# Altium schematic sheet DRV8301_driver.SchDoc
size 594 x 420 mm; SheetNumber: 5; SheetTotal: 8
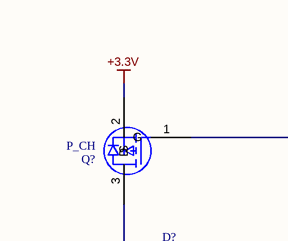
[diagram p0: DRV8301_driver.SchDoc, top left]
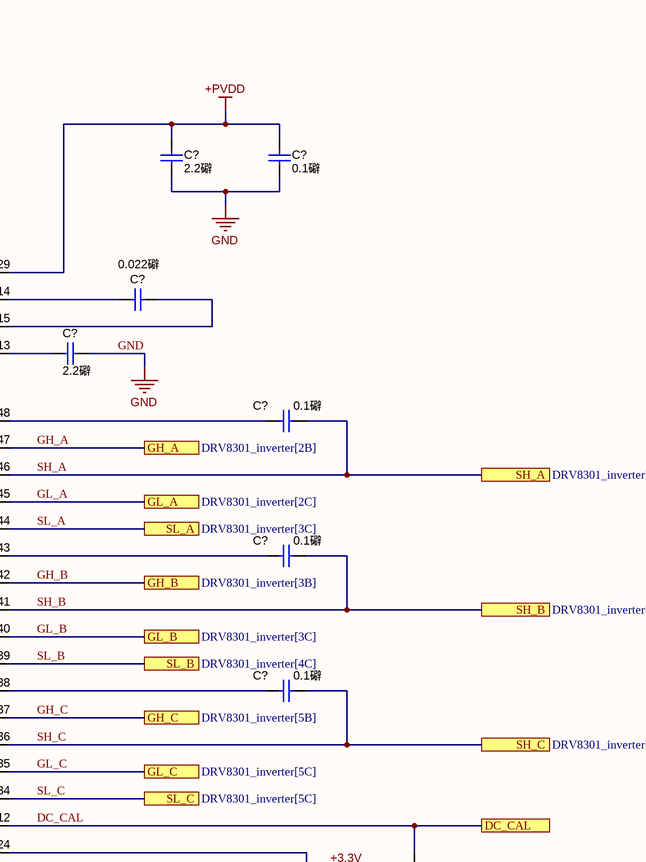
[diagram p1: DRV8301_driver.SchDoc, top right]
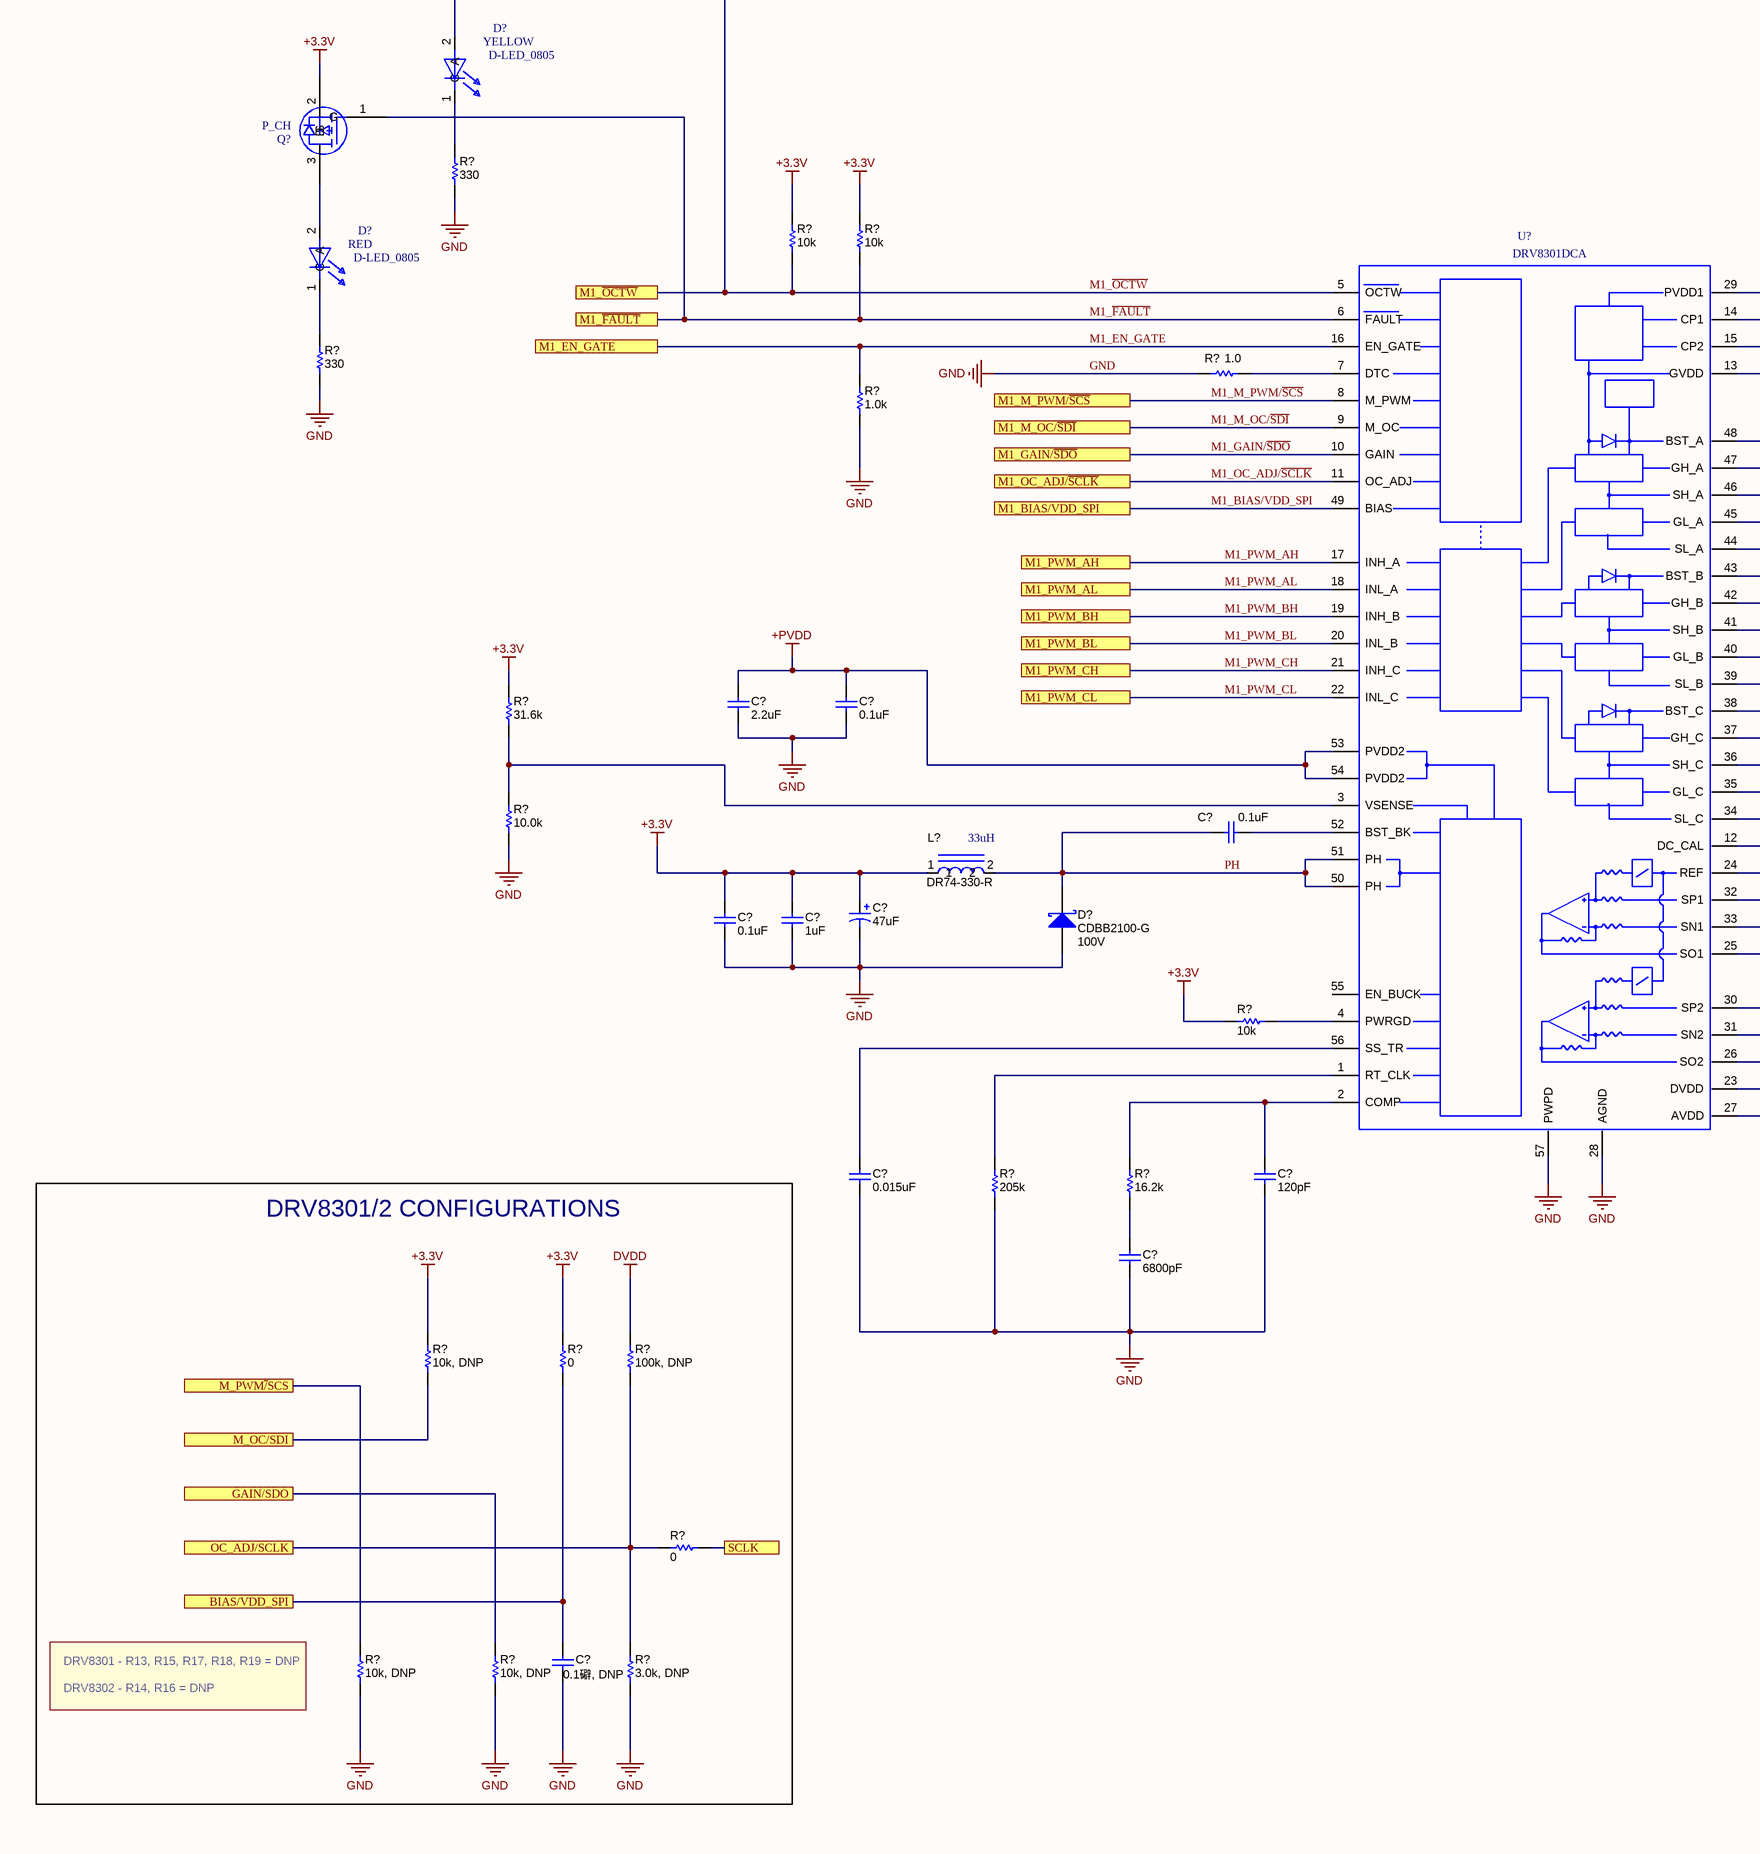
[diagram p2: DRV8301_driver.SchDoc, bottom left]
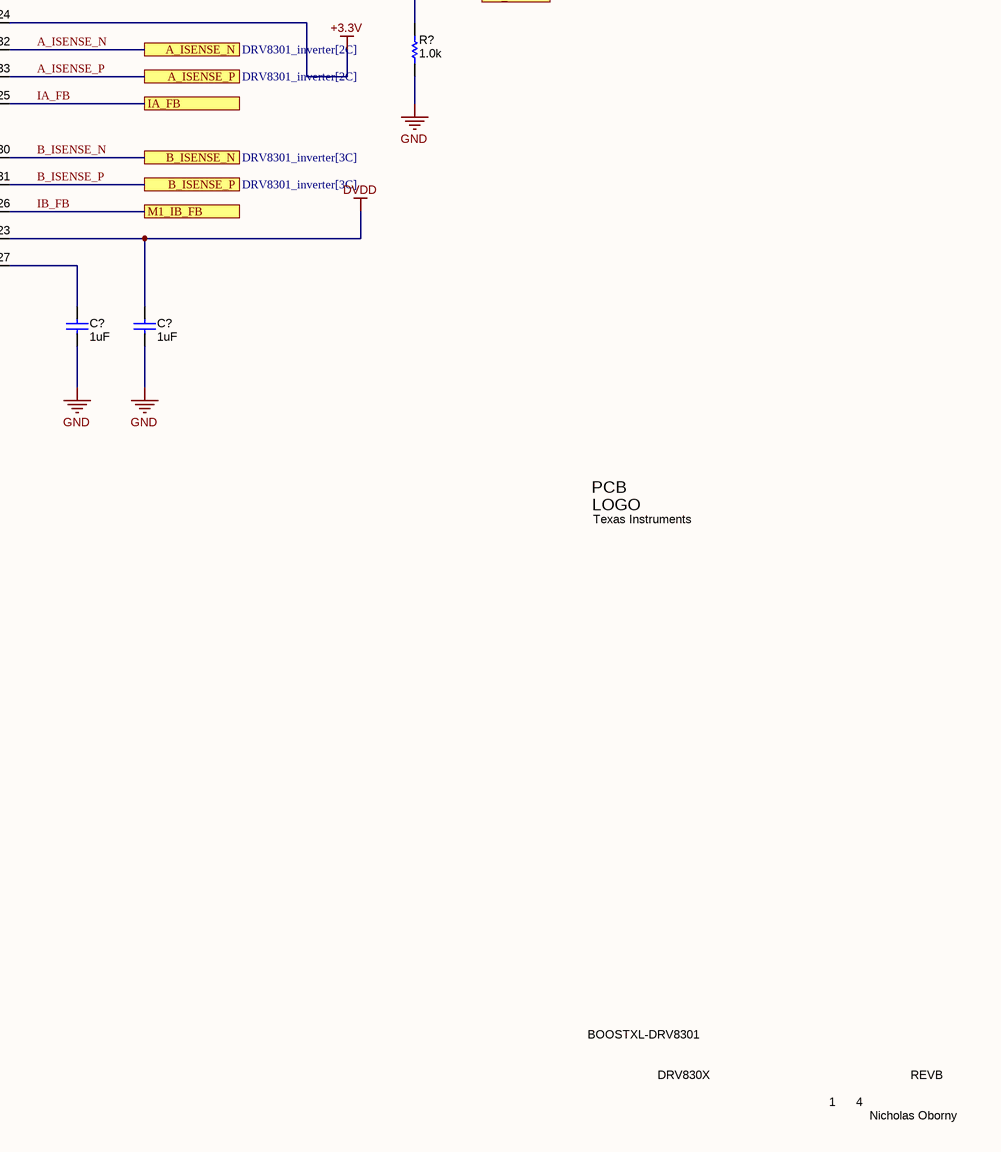
[diagram p3: DRV8301_driver.SchDoc, bottom right]

## Parts
(Parts that share a designator on the sheet are numbered #1, #2 ... from top to bottom, then left to right.)
C?#1  ValueDisplayed: 2.2礔  [1210L]  (hidden comment: GRM32ER72A225KA35L)
C?#2  ValueDisplayed: 0.1礔  [0603L]  (hidden comment: GRM188R72A104KA35D)
C?#3  ValueDisplayed: 0.022礔  [0603L]  (hidden comment: C1608X7R1H223K)
C?#4  ValueDisplayed: 2.2礔  [0805L]  (hidden comment: GRM219R61E225KA12D)
C?#5  ValueDisplayed: 0.1礔  [0603L]  (hidden comment: C1608X7R1H104K)
C?#6  ValueDisplayed: 0.1礔  [0603L]  (hidden comment: C1608X7R1H104K)
C?#7  ValueDisplayed: 2.2uF  [1210L]  (hidden comment: GRM32ER72A225KA35L)
C?#8  ValueDisplayed: 0.1uF  [0603L]  (hidden comment: GRM188R72A104KA35D)
C?#9  ValueDisplayed: 0.1礔  [0603L]  (hidden comment: C1608X7R1H104K)
C?#10  ValueDisplayed: 0.1uF  [0603L]  (hidden comment: C1608X7R1H104K)
C?#11  ValueDisplayed: 0.1uF  [0603L]  (hidden comment: C1608X7R1E104K)
C?#12  ValueDisplayed: 1uF  [0603L]  (hidden comment: C1608X5R1E105K080AC)
C?#13  ValueDisplayed: 47uF  [SM_RADIAL_D]  (hidden comment: EEE-FK1E470P)
C?#14  ValueDisplayed: 0.015uF  [0603L]  (hidden comment: GRM188R71H153KA01D)
C?#15  ValueDisplayed: 120pF  [0603L]  (hidden comment: GRM1885C1H121JA01D)
C?#16  ValueDisplayed: 1uF  [0603L]  (hidden comment: GRM188R61E105KA12D)
C?#17  ValueDisplayed: 1uF  [0603L]  (hidden comment: GRM188R61E105KA12D)
C?#18  ValueDisplayed: 6800pF  [0603L]  (hidden comment: GRM188R71H682KA01D)
C?#19  ValueDisplayed: 0.1礔, DNP  [0603L]  (hidden comment: C1608X7R1E104K)
D?#1  D-LED_0805  value YELLOW  [LED_0805]
D?#2  D-LED_0805  value RED  [LED_0805]
D?#3  CDBB2100-G  value 100V  [SMB]
L?  DR74-330-R  value 33uH  [IND_DR74]
Logo?  Texas Instruments  [TI_Symbol_Overlay_Small]  (no BOM)
Q?#1  value P_CH  [SOT-23]  (hidden comment: TR_PFET_SOT23)
Q?#2  value P_CH  [SOT-23]  (hidden comment: TR_PFET_SOT23)
R?#1  value 330  [0603L]  (hidden comment: CRCW0603330RJNEA)
R?#2  value 10k  [0603L]  (hidden comment: CRCW060310K0JNEA)
R?#3  value 10k  [0603L]  (hidden comment: CRCW060310K0JNEA)
R?#4  value 330  [0603L]  (hidden comment: CRCW0603330RJNEA)
R?#5  value 1.0  [0603L]  (hidden comment: CRCW06031R00JNEA)
R?#6  value 1.0k  [0603L]  (hidden comment: CRCW06031K00JNEA)
R?#7  value 31.6k  [0603L]  (hidden comment: CRCW060331K6FKEA)
R?#8  value 10.0k  [0603L]  (hidden comment: RG1608P-103-B-T5)
R?#9  value 1.0k  [0603L]  (hidden comment: CRCW06031K00JNEA)
R?#10  value 10k  [0603L]  (hidden comment: CRCW060310K0JNEA)
R?#11  value 205k  [0603L]  (hidden comment: CRCW0603205KFKEA)
R?#12  value 16.2k  [0603L]  (hidden comment: CRCW060316K2FKEA)
R?#13  value 10k, DNP  [0603L]  (hidden comment: CRCW060310K0JNEA)
R?#14  value 0  [0603L]  (hidden comment: CRCW06030000Z0EA)
R?#15  value 100k, DNP  [0603L]  (hidden comment: CRCW0603100KJNEA)
R?#16  value 0  [0603L]  (hidden comment: CRCW06030000Z0EA)
R?#17  value 10k, DNP  [0603L]  (hidden comment: CRCW060310K0JNEA)
R?#18  value 10k, DNP  [0603L]  (hidden comment: CRCW060310K0JNEA)
R?#19  value 3.0k, DNP  [0603L]  (hidden comment: CRCW06033K00JNEA)
U?  DRV8301DCA  [DCA_56P]

## Blocks framed on the sheet
DRV8301/2 CONFIGURATIONS: C?#19 R?#13-R?#19

## Ports
A_ISENSE_N (see DRV8301_inverter[2C]), A_ISENSE_P (see DRV8301_inverter[2C]), B_ISENSE_N (see DRV8301_inverter[3C]), B_ISENSE_P (see DRV8301_inverter[3C]), BIAS/VDD_SPI, DC_CAL, GAIN/SDO, GH_A (see DRV8301_inverter[2B]), GH_B (see DRV8301_inverter[3B]), GH_C (see DRV8301_inverter[5B]), GL_A (see DRV8301_inverter[2C]), GL_B (see DRV8301_inverter[3C]), GL_C (see DRV8301_inverter[5C]), IA_FB, M1_BIAS/VDD_SPI, M1_EN_GATE, M1_GAIN/~{SDO}, M1_IB_FB, M1_M_OC/~{SDI}, M1_M_PWM/~{SCS}, M1_OC_ADJ/~{SCLK}, M1_PWM_AH, M1_PWM_AL, M1_PWM_BH, M1_PWM_BL, M1_PWM_CH, M1_PWM_CL, M1_~{FAULT}, M1_~{OCTW}, M_OC/SDI, M_PWM~{/}SCS, OC_ADJ/SCLK, SCLK, SH_A (see DRV8301_inverter[3B], DRV8301_SENSE[1C]), SH_B (see DRV8301_inverter[4B], DRV8301_SENSE[1D]), SH_C (see DRV8301_inverter[5B], DRV8301_SENSE[1E]), SL_A (see DRV8301_inverter[3C]), SL_B (see DRV8301_inverter[4C]), SL_C (see DRV8301_inverter[5C])

## Nets
+3.3V: C?#11.1 C?#12.1 C?#13.1(+) L?.1 Q?#1.2(S) Q?#2.2(S) R?#2.2 R?#3.2 R?#7.2 R?#10.2 R?#13.2 R?#14.2 U?.24(REF)
+PVDD: C?#1.1 C?#2.1 C?#7.1 C?#8.1 U?.29(PVDD1) U?.53(PVDD2) U?.54(PVDD2)
DVDD: C?#17.1 R?#15.1 U?.23(DVDD)
GND: C?#1.2 C?#2.2 C?#4.2 C?#7.2 C?#8.2 C?#11.2 C?#12.2 C?#13.2(-) C?#14.2 C?#15.2 C?#16.2 C?#17.2 C?#18.2 C?#19.2 D?#3.2(A) R?#1.1 R?#4.1 R?#5.1 R?#6.1 R?#8.1 R?#9.1 R?#11.1 R?#17.1 R?#18.1 R?#19.1 U?.28(AGND) U?.57(PWPD)
A_ISENSE_N: U?.32(SP1) ; port A_ISENSE_N
A_ISENSE_P: U?.33(SN1) ; port A_ISENSE_P
B_ISENSE_N: U?.30(SP2) ; port B_ISENSE_N
B_ISENSE_P: U?.31(SN2) ; port B_ISENSE_P
BIAS/VDD_SPI: C?#19.1 R?#14.1 ; port BIAS/VDD_SPI
DC_CAL: R?#9.2 U?.12(DC_CAL) ; port DC_CAL
GAIN/SDO: R?#18.2 ; port GAIN/SDO
GH_A: U?.47(GH_A) ; port GH_A
GH_B: U?.42(GH_B) ; port GH_B
GH_C: U?.37(GH_C) ; port GH_C
GL_A: U?.45(GL_A) ; port GL_A
GL_B: U?.40(GL_B) ; port GL_B
GL_C: U?.35(GL_C) ; port GL_C
IA_FB: U?.25(SO1) ; port IA_FB
IB_FB: U?.26(SO2) ; port M1_IB_FB
M1_BIAS/VDD_SPI: U?.49(BIAS) ; port M1_BIAS/VDD_SPI
M1_EN_GATE: R?#6.2 U?.16(EN_GATE) ; port M1_EN_GATE
M1_~{FAULT}: Q?#2.1(G) R?#3.1 U?.6(FAULT) ; port M1_~{FAULT}
M1_GAIN/~{SDO}: U?.10(GAIN) ; port M1_GAIN/~{SDO}
M1_M_OC/~{SDI}: U?.9(M_OC) ; port M1_M_OC/~{SDI}
M1_M_PWM/~{SCS}: U?.8(M_PWM) ; port M1_M_PWM/~{SCS}
M1_~{OCTW}: Q?#1.1(G) R?#2.1 U?.5(OCTW) ; port M1_~{OCTW}
M1_OC_ADJ/~{SCLK}: U?.11(OC_ADJ) ; port M1_OC_ADJ/~{SCLK}
M1_PWM_AH: U?.17(INH_A) ; port M1_PWM_AH
M1_PWM_AL: U?.18(INL_A) ; port M1_PWM_AL
M1_PWM_BH: U?.19(INH_B) ; port M1_PWM_BH
M1_PWM_BL: U?.20(INL_B) ; port M1_PWM_BL
M1_PWM_CH: U?.21(INH_C) ; port M1_PWM_CH
M1_PWM_CL: U?.22(INL_C) ; port M1_PWM_CL
M_OC/SDI: R?#13.1 ; port M_OC/SDI
M_PWM~{/}SCS: R?#17.2 ; port M_PWM~{/}SCS
OC_ADJ/SCLK: R?#15.2 R?#16.2 R?#19.2 ; port OC_ADJ/SCLK
PH: C?#10.1 D?#3.1(K) L?.2 U?.50(PH) U?.51(PH)
SCLK: R?#16.1 ; port SCLK
SH_A: C?#5.2 U?.46(SH_A) ; port SH_A
SH_B: C?#6.2 U?.41(SH_B) ; port SH_B
SH_C: C?#9.2 U?.36(SH_C) ; port SH_C
SL_A: U?.44(SL_A) ; port SL_A
SL_B: U?.39(SL_B) ; port SL_B
SL_C: U?.34(SL_C) ; port SL_C
NetC?#3_1: C?#3.1 U?.14(CP1)
NetC?#3_2: C?#3.2 U?.15(CP2)
NetC?#4_1: C?#4.1 U?.13(GVDD)
NetC?#5_1: C?#5.1 U?.48(BST_A)
NetC?#6_1: C?#6.1 U?.43(BST_B)
NetC?#9_1: C?#9.1 U?.38(BST_C)
NetC?#10_2: C?#10.2 U?.52(BST_BK)
NetC?#14_1: C?#14.1 U?.56(SS_TR)
NetC?#15_1: C?#15.1 R?#12.2 U?.2(COMP)
NetC?#16_1: C?#16.1 U?.27(AVDD)
NetC?#18_1: C?#18.1 R?#12.1
NetD?#1_1: D?#1.1(C) R?#1.2
NetD?#1_2: D?#1.2(A) Q?#1.3(D)
NetD?#2_1: D?#2.1(C) R?#4.2
NetD?#2_2: D?#2.2(A) Q?#2.3(D)
NetR?#5_2: R?#5.2 U?.7(DTC)
NetR?#7_1: R?#7.1 R?#8.2 U?.3(VSENSE)
NetR?#10_1: R?#10.1 U?.4(PWRGD)
NetR?#11_2: R?#11.2 U?.1(RT_CLK)

Not connected (* = marked no-connect by the designer): U? 55(EN_BUCK)

## Notes on the sheet
- DRV8301 - R13, R15, R17, R18, R19 = DNP
- DRV8302 - R14, R16 = DNP
- BOOSTXL-DRV8301
- DRV830X
- 1
- 4
- Nicholas Oborny
- REVB
- DWG NO:
- REV:
- THIS DOCUMENT AND THE DATA DISCLOSED HEREIN OR
- HEREWITH IS THE PROPERTY OF ALTIUM LIMITED AND MAY
- BE FREELY DISTRIBUTED IN WHOLE. NO RIGHTS ARE
- RESERVED OR EXPRESS OR IMPLIED WARANTEE GIVEN.
- REVISION
- DESCRIPTION
- DATE
- APPROVED
- ENG:
- APPROVALS
- PROJECT
- DSN:
- CHK:
- REFERENCE DOCUMENTS
- PROJECT REVISION:
- TITLE
- DOCUMENT REVISION:
- DESIGN ITEM:
- BOM:
- FAB DWG:
- PCB DWG:
- ASSY DWG:
- SCALE:
- A2
- SIZE
- CAGE CODE
- FILE NAME
- DWG NO.
- SHEET
- OF
- REV
- (in symbol TI_Logo) PCB; LOGO

## Library data of the parts
C?#1 C?#7 = GRM32ER72A225KA35L: CAP, CERM, 2.2uF, 100V, +/-10%, X7R, 1210; Manufacturer: MuRata; Polarized: N; CompType: Capacitor; U/M: EA; Cap_F: 0.0000022; Tolerance_%: 10; ESR_Ohm: 0.007; Value1: 0.007 ohm; VDC_V: 100; IRMS_A: 4.4; TaMin_C: -55; TaMax_C: 125; Cap_Case: 1210; SymbolVersion: 2008-07-09; Value: 2.2uF; PartNumber: GRM32ER72A225KA35L; PackageReference: 1210; RoHS: Y; Value2: 100V; MountType: SMT; Technology: Ceramic; TempCo: X7R; Published: 2008-06-19; Publisher: Texas Instruments; LatestRevisionDate: 2013-05-24; LatestRevisionNote: Changed publisher; ComponentLink1Description: Datasheet link; ComponentLink1URL: http://search.murata.co.jp/Ceramy/PnsearchViewAction.do?HnOFG=ON&HnNFG=ON&SEL_CNT=50&sLang=en&sKey=GRM32ER72A225KA35L&x=9&y=9&search=startwith; Supplier 1: Digi-Key; Supplier Part Number 1: 490-3385-1-ND; Supplier 2: Mouser; Supplier Part Number 2: 81-GRM32ER72A225KA35; Supplier 3: Farnell; Supplier Part Number 3: 1735547
C?#2 C?#8 = GRM188R72A104KA35D: CAP, CERM, 0.1uF, 100V, +/-10%, X7R, 0603; Manufacturer: MuRata; Polarized: N; CompType: Capacitor; U/M: EA; Cap_F: 0.0000001; Tolerance_%: 10; Value1: Unknown; VDC_V: 100; TaMin_C: -55; TaMax_C: 125; Cap_Case: 0603; SymbolVersion: 2008-07-09; Value: 0.1uF; PartNumber: GRM188R72A104KA35D; PackageReference: 0603; RoHS: Y; Value2: 100V; MountType: SMT; Technology: Ceramic; TempCo: X7R; Published: 2008-06-19; Publisher: Texas Instruments; LatestRevisionDate: 2013-05-24; LatestRevisionNote: Changed publisher; ComponentLink1Description: Datasheet link; ComponentLink1URL: http://search.murata.co.jp/Ceramy/PnsearchViewAction.do?HnOFG=ON&HnNFG=ON&SEL_CNT=50&sLang=en&sKey=GRM188R72A104KA35D&x=9&y=9&search=startwith; Supplier 1: Digi-Key; Supplier Part Number 1: 490-3285-1-ND; Supplier 2: Mouser; Supplier Part Number 2: 81-GRM188R72A104KA35; Supplier 3: Farnell; Supplier Part Number 3: 1828921
C?#3 = C1608X7R1H223K: CAP, CERM, 0.022uF, 50V, +/-10%, X7R, 0603; Manufacturer: TDK; Polarized: N; CompType: Capacitor; U/M: EA; Cap_F: 0.000000022; Tolerance_%: 10; ESR_Ohm: 0.0383; Value1: 0.0383 ohm; VDC_V: 50; TaMin_C: -55; TaMax_C: 125; Cap_Case: 0603; SymbolVersion: 2008-07-09; Value: 0.022uF; PartNumber: C1608X7R1H223K; PackageReference: 0603; RoHS: Y; Value2: 50V; MountType: SMT; Technology: Ceramic; TempCo: X7R; Published: 2008-06-19; Publisher: Texas Instruments; LatestRevisionDate: 2013-05-24; LatestRevisionNote: Changed publisher; ComponentLink1Description: Datasheet link; ComponentLink1URL: http://www.tdk.co.jp/tefe02/e412_c.pdf; Supplier 1: Digi-Key; Supplier Part Number 1: 445-1312-1-ND; Supplier 2: Farnell; Supplier Part Number 2: 1907316
C?#4 = GRM219R61E225KA12D: CAP, CERM, 2.2uF, 25V, +/-10%, X5R, 0805; Manufacturer: MuRata; Polarized: N; CompType: Capacitor; U/M: EA; Cap_F: 0.0000022; Tolerance_%: 10; ESR_Ohm: 0.006; Value1: 0.006 ohm; VDC_V: 25; TaMin_C: -55; TaMax_C: 85; Cap_Case: 0805; SymbolVersion: 2008-07-09; Value: 2.2uF; PartNumber: GRM219R61E225KA12D; PackageReference: 0805; RoHS: Y; Value2: 25V; MountType: SMT; Technology: Ceramic; TempCo: X5R; Published: 2008-06-19; Publisher: Texas Instruments; LatestRevisionDate: 2013-05-24; LatestRevisionNote: Changed publisher; ComponentLink1Description: Datasheet link; ComponentLink1URL: http://search.murata.co.jp/Ceramy/PnsearchViewAction.do?HnOFG=ON&HnNFG=ON&SEL_CNT=50&sLang=en&sKey=GRM219R61E225KA12D&x=9&y=9&search=startwith; Supplier 1: Digi-Key; Supplier Part Number 1: 490-1701-1-ND; Supplier 2: Mouser; Supplier Part Number 2: 81-GRM219R61E225K; Supplier 3: Farnell; Supplier Part Number 3: 1845749
C?#5 C?#6 C?#9 C?#10 = C1608X7R1H104K: CAP, CERM, 0.1uF, 50V, +/-10%, X7R, 0603; Manufacturer: TDK; Polarized: N; CompType: Capacitor; U/M: EA; Cap_F: 0.0000001; Tolerance_%: 10; ESR_Ohm: 0.017; Value1: 0.017 ohm; VDC_V: 50; TaMin_C: -55; TaMax_C: 125; Cap_Case: 0603; SymbolVersion: 2008-07-09; Value: 0.1uF; PartNumber: C1608X7R1H104K; PackageReference: 0603; RoHS: Y; Value2: 50V; MountType: SMT; Technology: Ceramic; TempCo: X7R; Published: 2008-06-19; Publisher: Texas Instruments; LatestRevisionDate: 2013-05-24; LatestRevisionNote: Changed publisher; ComponentLink1Description: Datasheet link; ComponentLink1URL: http://www.tdk.co.jp/tefe02/e412_c.pdf; Supplier 1: Digi-Key; Supplier Part Number 1: 445-1314-1-ND; Supplier 2: Farnell; Supplier Part Number 2: 1118182
C?#11 C?#19 = C1608X7R1E104K: CAP, CERM, 0.1uF, 25V, +/-10%, X7R, 0603; Manufacturer: TDK; Polarized: N; CompType: Capacitor; U/M: EA; Cap_F: 0.0000001; Tolerance_%: 10; ESR_Ohm: 0.017; Value1: 0.017 ohm; VDC_V: 25; TaMin_C: -55; TaMax_C: 125; Cap_Case: 0603; SymbolVersion: 2008-07-09; Value: 0.1uF; PartNumber: C1608X7R1E104K; PackageReference: 0603; RoHS: Y; Value2: 25V; MountType: SMT; Technology: Ceramic; TempCo: X7R; Published: 2008-06-19; Publisher: Texas Instruments; LatestRevisionDate: 2013-05-24; LatestRevisionNote: Changed publisher; ComponentLink1Description: Datasheet link; ComponentLink1URL: http://www.tdk.co.jp/tefe02/e412_c.pdf; Supplier 1: Digi-Key; Supplier Part Number 1: 445-1316-1-ND; Supplier 2: Farnell; Supplier Part Number 2: 1844230
C?#12 = C1608X5R1E105K080AC: CAP, CERM, 1uF, 25V, +/-10%, X5R, 0603; Manufacturer: TDK; Polarized: N; CompType: Capacitor; U/M: EA; Cap_F: 0.000001; Tolerance_%: 10; Value1: Unknown; VDC_V: 25; TaMin_C: -55; TaMax_C: 85; Cap_Case: 0603; SymbolVersion: 2008-07-09; Value: 1uF; PartNumber: C1608X5R1E105K080AC; PackageReference: 0603; RoHS: Y; Value2: 25V; MountType: SMT; Technology: Ceramic; TempCo: X5R; Published: 2008-06-19; Publisher: Texas Instruments; LatestRevisionDate: 2013-05-24; LatestRevisionNote: Changed publisher; ComponentLink1Description: Datasheet link; ComponentLink1URL: http://product.tdk.com/capacitor/mlcc/en/documents/mlcc_commercial_general_en.pdf; Supplier 1: Digi-Key; Supplier Part Number 1: 445-5146-1-ND; Supplier 2: Newark; Supplier Part Number 2: 90R7677
C?#13 = EEE-FK1E470P: CAP, AL, 47uF, 25V, +/-20%, 0.36 ohm, SMD; Manufacturer: Panasonic; Polarized: Y; CompType: Capacitor; U/M: EA; Cap_F: 0.000047; Tolerance_%: 20; VDC_V: 25; ESR_Ohm: 0.36; IRMS_A: 0.24; TaMin_C: -55; TaMax_C: 105; Cap_Case: D; SymbolVersion: 2008-07-09; Value: 47uF; PartNumber: EEE-FK1E470P; PackageReference: SMT Radial D; RoHS: Y; Value1: 0.36 ohm; Value2: 25V; MountType: SMT; Technology: AL; Series: FK; Publisher: Texas Instruments; LatestRevisionDate: 2013-05-31; ComponentLink1Description: Datasheet link; ComponentLink1URL: http://www.panasonic.com/industrial/components/pdf/smt_aec_050505.pdf; Supplier 1: Digi-Key; Supplier Part Number 1: PCE3804CT-ND; Supplier 2: Mouser; Supplier Part Number 2: 667-EEE-FK1E470P; Supplier 3: Farnell; Supplier Part Number 3: 9695753
C?#14 = GRM188R71H153KA01D: CAP, CERM, 0.015uF, 50V, +/-10%, X7R, 0603; Manufacturer: MuRata; Polarized: N; CompType: Capacitor; U/M: EA; Cap_F: 0.000000015; Tolerance_%: 10; Value1: Unknown; VDC_V: 50; TaMin_C: -55; TaMax_C: 125; Cap_Case: 0603; SymbolVersion: 2008-07-09; Value: 0.015uF; PartNumber: GRM188R71H153KA01D; PackageReference: 0603; RoHS: Y; Value2: 50V; MountType: SMT; Technology: Ceramic; TempCo: X7R; Published: 2008-06-19; Publisher: Texas Instruments; LatestRevisionDate: 2013-05-24; LatestRevisionNote: Changed publisher; ComponentLink1Description: Datasheet link; ComponentLink1URL: http://search.murata.co.jp/Ceramy/PnsearchViewAction.do?HnOFG=ON&HnNFG=ON&SEL_CNT=50&sLang=en&sKey=GRM188R71H153KA01D&x=9&y=9&search=startwith; Supplier 1: Digi-Key; Supplier Part Number 1: 490-1514-1-ND; Supplier 2: Mouser; Supplier Part Number 2: 81-GRM18R71H153KA01D; Supplier 3: Farnell; Supplier Part Number 3: 1828916
C?#15 = GRM1885C1H121JA01D: CAP, CERM, 120pF, 50V, +/-5%, C0G/NP0, 0603; Manufacturer: MuRata; Polarized: N; CompType: Capacitor; U/M: EA; Cap_F: 0.00000000012; Tolerance_%: 5; Value1: Unknown; VDC_V: 50; TaMin_C: -55; TaMax_C: 125; Cap_Case: 0603; SymbolVersion: 2008-07-09; Value: 120pF; PartNumber: GRM1885C1H121JA01D; PackageReference: 0603; RoHS: Y; Value2: 50V; MountType: SMT; Technology: Ceramic; TempCo: C0G/NP0; Published: 2008-06-19; Publisher: Texas Instruments; LatestRevisionDate: 2013-05-24; LatestRevisionNote: Changed publisher; ComponentLink1Description: Datasheet link; ComponentLink1URL: http://search.murata.co.jp/Ceramy/PnsearchViewAction.do?HnOFG=ON&HnNFG=ON&SEL_CNT=50&sLang=en&sKey=GRM1885C1H121JA01D&x=9&y=9&search=startwith; Supplier 1: Digi-Key; Supplier Part Number 1: 490-1429-1-ND; Supplier 2: Mouser; Supplier Part Number 2: 81-GRM39C121J50; Supplier 3: Farnell; Supplier Part Number 3: 1403555
C?#16 C?#17 = GRM188R61E105KA12D: CAP, CERM, 1uF, 25V, +/-10%, X5R, 0603; Manufacturer: MuRata; Polarized: N; CompType: Capacitor; U/M: EA; Cap_F: 0.000001; Tolerance_%: 10; Value1: Unknown; VDC_V: 25; TaMin_C: -55; TaMax_C: 85; Cap_Case: 0603; SymbolVersion: 2008-07-09; Value: 1uF; PartNumber: GRM188R61E105KA12D; PackageReference: 0603; RoHS: Y; Value2: 25V; MountType: SMT; Technology: Ceramic; TempCo: X5R; Published: 2008-06-19; Publisher: Texas Instruments; LatestRevisionDate: 2013-05-24; LatestRevisionNote: Changed publisher; ComponentLink1Description: Datasheet link; ComponentLink1URL: http://search.murata.co.jp/Ceramy/PnsearchViewAction.do?HnOFG=ON&HnNFG=ON&SEL_CNT=50&sLang=en&sKey=GRM188R61E105KA12D&x=9&y=9&search=startwith; Supplier 1: Digi-Key; Supplier Part Number 1: 490-3897-1-ND; Supplier 2: Mouser; Supplier Part Number 2: 81-GRM188R61E105KA12; Supplier 3: Farnell; Supplier Part Number 3: 1828802
C?#18 = GRM188R71H682KA01D: CAP, CERM, 6800pF, 50V, +/-10%, X7R, 0603; Manufacturer: MuRata; Polarized: N; CompType: Capacitor; U/M: EA; Cap_F: 0.0000000068; Tolerance_%: 10; Value1: Unknown; VDC_V: 50; TaMin_C: -55; TaMax_C: 125; Cap_Case: 0603; SymbolVersion: 2008-07-09; Value: 6800pF; PartNumber: GRM188R71H682KA01D; PackageReference: 0603; RoHS: Y; Value2: 50V; MountType: SMT; Technology: Ceramic; TempCo: X7R; Published: 2008-06-19; Publisher: Texas Instruments; LatestRevisionDate: 2013-05-24; LatestRevisionNote: Changed publisher; ComponentLink1Description: Datasheet link; ComponentLink1URL: http://search.murata.co.jp/Ceramy/PnsearchViewAction.do?HnOFG=ON&HnNFG=ON&SEL_CNT=50&sLang=en&sKey=GRM188R71H682KA01D&x=9&y=9&search=startwith; Supplier 1: Digi-Key; Supplier Part Number 1: 490-1508-1-ND; Supplier 2: Mouser; Supplier Part Number 2: 81-GRM39X682K50D; Supplier 3: Farnell; Supplier Part Number 3: 1403792
D?#1 = D-LED_0805: LED THIN 585NM YEL DIFF 0805 SMD; PartNumber: SML-LXT0805YW-TR; Manufacturer: Lumex Opto/Components Inc; Vendor Part #: 67-1554-1-ND; PCB DECAL: LED-0805DA; Vendor: DigiKey; ModifyDate: 10/26/2011 10:26:35; ComponentHeight: 0.80 mm; Size: 805
D?#2 = D-LED_0805: LED THIN660NM SUPRED DIFF0805SMD; PartNumber: SML-LXT0805SRW-TR; Manufacturer: Lumex Opto/Components Inc; Vendor Part #: 67-1555-1-ND; Vendor: DigiKey; ModifyDate: 10/26/2011 10:26:35; PCB DECAL: LED-0805; ComponentHeight: 0.80 mm; Size: 805
D?#3 = CDBC5100-G: Diode, Schottky, 100V, 2A, SMB; Manufacturer: Comchip Technology; U/M: EA; Vf_V: 0.85; Value2: 0.85V; Io_A: 2; Vr_V: 100; TJmax_C: 125; CompType: Diode; SymbolVersion: 2008-12-08; PartNumber: CDBB2100-G; PackageReference: SMB; Value1: 2A; MountType: SMT; Type: Schottky; RoHS: Y; Published: 2008-06-26; Publisher: Texas Instruments; LatestRevisionDate: 2013-06-04; ComponentLink1Description: Datasheet link; ComponentLink1URL: http://www.comchiptech.com/cms/UserFiles/CDBB220-G%20Thru935254.%20CDBB2100-G%20RevB.pdf; Supplier 1: Digi-Key; Supplier Part Number 1: 641-1109-1-ND; Supplier 2: Mouser; Supplier Part Number 2: 750-CDBB2100-G
L? = IND_DR74-XXX: INDUCTOR SHIELD PWR 33UH SMD; Manufacturer: Cooper Bussmann; Area: 122500; ComponentLink1URL: \\vette02\pmp_pcb\pcad_pdf's\DR series inductor.pdf; ComponentHeight: 0.175; PackageReference: 0.300" sq; SymbolVersion: 07/31/2009 12:17:29; PartNumber: DR74-330-R; ComponentLink1Description: AEO Datasheet Link
Logo? = TI_Logo: Texas Instrument Corporate Signature; SymbolCreator: codlsc; SymbolVersion: 2011-08-22; ClassName: Logo; Published: 2009-03-03; Publisher: Texas Instruments; LatestRevisionDate: 2012-05-17; LatestRevisionNote: Changed publisher
Q?#1 Q?#2 = TR_PFET_SOT23: MOSFET P-CH 8V 5.4A SOT23-3; PartNumber: SI2325DS-T1-E3; Manufacturer: Vishey Siliconix; Vendor Part #: S12325DS-T1-E3CT-ND; Vendor: DigiKey; ModifyDate: 11/01/2006 14:12:04; ComponentHeight: 0.043 inch; PCB DECAL: SOT-23; Size: SOT-23
R?#1 R?#4 = CRCW0603330RJNEA: RES, 330 ohm, 5%, 0.1W, 0603; Manufacturer: Vishay-Dale; CompType: Resistor; Value_Code: 330R; Tolerance_%: 5; Power_W: 0.1; VDC_V: 75; TempCo: 200 ppm/C; EIA_Code: E24; U/M: EA; SymbolVersion: 2009-05-29; PartNumber: CRCW0603330RJNEA; PackageReference: 0603; RoHS: Y; Res_ohm: 330; Value1: 5%; Value2: 0.1W; MountType: SMT; Technology: Thick Film; Published: 2008-06-26; Publisher: Texas Instruments; LatestRevisionDate: 2013-01-08; ComponentLink1Description: Datasheet link; ComponentLink1URL: http://www.vishay.com/docs/20035/dcrcwe3.pdf; Supplier 1: Digi-Key; Supplier Part Number 1: 541-330GCT-ND; Supplier 2: Mouser; Supplier Part Number 2: 71-CRCW0603J-330-E3; Supplier 3: Farnell; Supplier Part Number 3: 1692522
R?#2 R?#3 R?#10 = CRCW060310K0JNEA: RES, 10k ohm, 5%, 0.1W, 0603; Manufacturer: Vishay-Dale; CompType: Resistor; Res_ohm: 10000; Value_Code: 10k0; Tolerance_%: 5; Power_W: 0.1; VDC_V: 75; TempCo: 200 ppm/C; EIA_Code: E24; U/M: EA; SymbolVersion: 2009-05-29; PartNumber: CRCW060310K0JNEA; PackageReference: 0603; RoHS: Y; Value1: 5%; Value2: 0.1W; MountType: SMT; Technology: Thick Film; Published: 2008-06-26; Publisher: Texas Instruments; LatestRevisionDate: 2013-01-08; ComponentLink1Description: Datasheet link; ComponentLink1URL: http://www.vishay.com/docs/20035/dcrcwe3.pdf; Supplier 1: Digi-Key; Supplier Part Number 1: 541-10KGCT-ND; Supplier 2: Farnell; Supplier Part Number 2: 1562240; Supplier 3: Newark; Supplier Part Number 3: 52K8066
R?#5 = CRCW06031R00JNEA: RES, 1.0 ohm, 5%, 0.1W, 0603; Manufacturer: Vishay-Dale; CompType: Resistor; Res_ohm: 1; Value_Code: 1R00; Tolerance_%: 5; Power_W: 0.1; VDC_V: 75; TempCo: 200 ppm/C; EIA_Code: E24; U/M: EA; SymbolVersion: 2009-05-29; PartNumber: CRCW06031R00JNEA; PackageReference: 0603; RoHS: Y; Value1: 5%; Value2: 0.1W; MountType: SMT; Technology: Thick Film; Published: 2008-06-26; Publisher: Texas Instruments; LatestRevisionDate: 2013-01-08; ComponentLink1Description: Datasheet link; ComponentLink1URL: http://www.vishay.com/docs/20035/dcrcwe3.pdf; Supplier 1: Digi-Key; Supplier Part Number 1: 541-1.0GCT-ND; Supplier 2: Mouser; Supplier Part Number 2: 71-CRCW0603J-1-E3; Supplier 3: Farnell; Supplier Part Number 3: 1514709
R?#6 R?#9 = CRCW06031K00JNEA: RES, 1.0k ohm, 5%, 0.1W, 0603; Manufacturer: Vishay-Dale; CompType: Resistor; Res_ohm: 1000; Value_Code: 1k00; Tolerance_%: 5; Power_W: 0.1; VDC_V: 75; TempCo: 200 ppm/C; EIA_Code: E24; U/M: EA; SymbolVersion: 2009-05-29; PartNumber: CRCW06031K00JNEA; PackageReference: 0603; RoHS: Y; Value1: 5%; Value2: 0.1W; MountType: SMT; Technology: Thick Film; Published: 2008-06-26; Publisher: Texas Instruments; LatestRevisionDate: 2013-01-08; ComponentLink1Description: Datasheet link; ComponentLink1URL: http://www.vishay.com/docs/20035/dcrcwe3.pdf; Supplier 1: Digi-Key; Supplier Part Number 1: 541-1.0KGCT-ND; Supplier 2: Farnell; Supplier Part Number 2: 1652851; Supplier 3: Newark; Supplier Part Number 3: 59M6750
R?#7 = CRCW060331K6FKEA: RES, 31.6k ohm, 1%, 0.1W, 0603; Manufacturer: Vishay-Dale; CompType: Resistor; Res_ohm: 31600; Value_Code: 31k6; Tolerance_%: 1; Power_W: 0.1; VDC_V: 75; TempCo: 100 ppm/C; EIA_Code: E96; U/M: EA; SymbolVersion: 2009-05-29; PartNumber: CRCW060331K6FKEA; PackageReference: 0603; RoHS: Y; Value1: 1%; Value2: 0.1W; MountType: SMT; Technology: Thick Film; Published: 2008-06-26; Publisher: Texas Instruments; LatestRevisionDate: 2013-01-08; ComponentLink1Description: Datasheet link; ComponentLink1URL: http://www.vishay.com/docs/20035/dcrcwe3.pdf; Supplier 1: Digi-Key; Supplier Part Number 1: 541-31.6KHCT-ND; Supplier 2: Mouser; Supplier Part Number 2: 71-CRCW0603-31.6K-E3; Supplier 3: Farnell; Supplier Part Number 3: 1151933
R?#8 = RG1608P-103-B-T5: RES, 10.0k ohm, 0.1%, 0.1W, 0603; Manufacturer: Susumu Co Ltd; CompType: Resistor; Res_ohm: 10000; Value_Code: 10k0; Tolerance_%: 0.1; VDC_V: 75; TempCo: 25 ppm/C; EIA_Code: E192; U/M: EA; SymbolVersion: 2009-05-29; PartNumber: RG1608P-103-B-T5; PackageReference: 0603; RoHS: Y; Value1: 0.1%; Power_W: 0.1; Value2: 0.1W; MountType: SMT; Technology: Metal Film; Published: 2008-06-26; Publisher: Texas Instruments; LatestRevisionDate: 2013-01-08; ComponentLink1Description: Datasheet link; ComponentLink1URL: http://www.susumu.co.jp/english/pdf/products-j01-01.pdf; Supplier 1: Digi-Key; Supplier Part Number 1: RG16P10.0KBCT-ND; Supplier 2: Mouser; Supplier Part Number 2: 754-RG1608P-103-B-T5; Supplier 3: Farnell; Supplier Part Number 3: 1797079
R?#11 = CRCW0603205KFKEA: RES, 205k ohm, 1%, 0.1W, 0603; Manufacturer: Vishay-Dale; CompType: Resistor; Res_ohm: 205000; Tolerance_%: 1; Power_W: 0.1; VDC_V: 75; TempCo: 100 ppm/C; EIA_Code: E96; U/M: EA; SymbolVersion: 2009-05-29; PartNumber: CRCW0603205KFKEA; PackageReference: 0603; RoHS: Y; Value_Code: 205k; Value1: 1%; Value2: 0.1W; MountType: SMT; Technology: Thick Film; Published: 2008-06-26; Publisher: Texas Instruments; LatestRevisionDate: 2013-01-08; ComponentLink1Description: Datasheet link; ComponentLink1URL: http://www.vishay.com/docs/20035/dcrcwe3.pdf; Supplier 1: Digi-Key; Supplier Part Number 1: 541-205KHCT-ND; Supplier 2: Mouser; Supplier Part Number 2: 71-CRCW0603-205K-E3; Supplier 3: Farnell; Supplier Part Number 3: 1151818
R?#12 = CRCW060316K2FKEA: RES, 16.2k ohm, 1%, 0.1W, 0603; Manufacturer: Vishay-Dale; CompType: Resistor; Res_ohm: 16200; Value_Code: 16k2; Tolerance_%: 1; Power_W: 0.1; VDC_V: 75; TempCo: 100 ppm/C; EIA_Code: E96; U/M: EA; SymbolVersion: 2009-05-29; PartNumber: CRCW060316K2FKEA; PackageReference: 0603; RoHS: Y; Value1: 1%; Value2: 0.1W; MountType: SMT; Technology: Thick Film; Published: 2008-06-26; Publisher: Texas Instruments; LatestRevisionDate: 2013-01-08; ComponentLink1Description: Datasheet link; ComponentLink1URL: http://www.vishay.com/docs/20035/dcrcwe3.pdf; Supplier 1: Digi-Key; Supplier Part Number 1: 541-16.2KHCT-ND; Supplier 2: Mouser; Supplier Part Number 2: 71-CRCW0603-16.2K-E3; Supplier 3: Farnell; Supplier Part Number 3: 1151719
R?#13 R?#17 R?#18 = CRCW060310K0JNEA: RES, 10k ohm, 5%, 0.1W, 0603; Manufacturer: Vishay-Dale; Alternate Manufacturer: DNP; CompType: Resistor; Res_ohm: 10000; Value_Code: 10k0; Tolerance_%: 5; Power_W: 0.1; VDC_V: 75; TempCo: 200 ppm/C; EIA_Code: E24; U/M: EA; SymbolVersion: 2009-05-29; PartNumber: CRCW060310K0JNEA; PackageReference: 0603; RoHS: Y; Value1: 5%; Value2: 0.1W; MountType: SMT; Technology: Thick Film; Published: 2008-06-26; Publisher: Texas Instruments; LatestRevisionDate: 2013-01-08; ComponentLink1Description: Datasheet link; ComponentLink1URL: http://www.vishay.com/docs/20035/dcrcwe3.pdf; Alternate PartNumber: DNP; Supplier 1: Digi-Key; Supplier Part Number 1: 541-10KGCT-ND; Supplier 2: Farnell; Supplier Part Number 2: 1562240; Supplier 3: Newark; Supplier Part Number 3: 52K8066
R?#14 R?#16 = CRCW06030000Z0EA: RES, 0 ohm, 5%, 0.1W, 0603; Manufacturer: Vishay-Dale; CompType: Resistor; Value_Code: 0000; Tolerance_%: 5; Power_W: 0.1; VDC_V: 75; TempCo: 200 ppm/C; EIA_Code: E24; U/M: EA; SymbolVersion: 2009-05-29; PartNumber: CRCW06030000Z0EA; PackageReference: 0603; RoHS: Y; Res_ohm: 0; Value1: 5%; Value2: 0.1W; MountType: SMT; Technology: Thick Film; Published: 2008-06-26; Publisher: Texas Instruments; LatestRevisionDate: 2013-01-08; ComponentLink1Description: Datasheet link; ComponentLink1URL: http://www.vishay.com/docs/20035/dcrcwe3.pdf; Supplier 1: Digi-Key; Supplier Part Number 1: 541-0.0GCT-ND; Supplier 2: Mouser; Supplier Part Number 2: 71-CRCW0603-0-E3; Supplier 3: Farnell; Supplier Part Number 3: 1469739
R?#15 = CRCW0603100KJNEA: RES, 100k ohm, 5%, 0.1W, 0603; Manufacturer: Vishay-Dale; Alternate Manufacturer: DNP; CompType: Resistor; Res_ohm: 100000; Tolerance_%: 5; Power_W: 0.1; VDC_V: 75; TempCo: 200 ppm/C; EIA_Code: E24; U/M: EA; SymbolVersion: 2009-05-29; PartNumber: CRCW0603100KJNEA; PackageReference: 0603; RoHS: Y; Value_Code: 100k; Value1: 5%; Value2: 0.1W; MountType: SMT; Technology: Thick Film; Published: 2008-06-26; Publisher: Texas Instruments; LatestRevisionDate: 2013-01-08; ComponentLink1Description: Datasheet link; ComponentLink1URL: http://www.vishay.com/docs/20035/dcrcwe3.pdf; Alternate PartNumber: DNP; Supplier 1: Mouser; Supplier Part Number 1: 71-CRCW0603J-100K-E3; Supplier 2: Farnell; Supplier Part Number 2: 1692517; Supplier 3: Newark; Supplier Part Number 3: 59M6763
R?#19 = CRCW06033K00JNEA: RES, 3.0k ohm, 5%, 0.1W, 0603; Manufacturer: Vishay-Dale; Alternate Manufacturer: DNP; CompType: Resistor; Res_ohm: 3000; Value_Code: 3k00; Tolerance_%: 5; Power_W: 0.1; VDC_V: 75; TempCo: 200 ppm/C; EIA_Code: E24; U/M: EA; SymbolVersion: 2009-05-29; PartNumber: CRCW06033K00JNEA; PackageReference: 0603; RoHS: Y; Value1: 5%; Value2: 0.1W; MountType: SMT; Technology: Thick Film; Published: 2008-06-26; Publisher: Texas Instruments; LatestRevisionDate: 2013-01-08; ComponentLink1Description: Datasheet link; ComponentLink1URL: http://www.vishay.com/docs/20035/dcrcwe3.pdf; Alternate PartNumber: DNP; Supplier 1: Mouser; Supplier Part Number 1: 71-CRCW0603J-3.0K-E3; Supplier 2: Farnell; Supplier Part Number 2: 1563613; Supplier 3: Newark; Supplier Part Number 3: 72M6833
U? = DRV8302DCA_ERIC: IC, 3 Phase Pre-Driver with Dual Current Shunt Amplifiers and Buck Regulator-Hardware Controlled; Manufacturer: Texas Instruments; Area: 154.44 mm; Vendor: Supplied; Value: DRV8301DCA; ModifyDate: 05/02/2012 07:50:13; PartNumber: DRV8301DCA; Size: HTSSOP; PCB DECAL: DCA_56P; Vendor Part #: Supplied